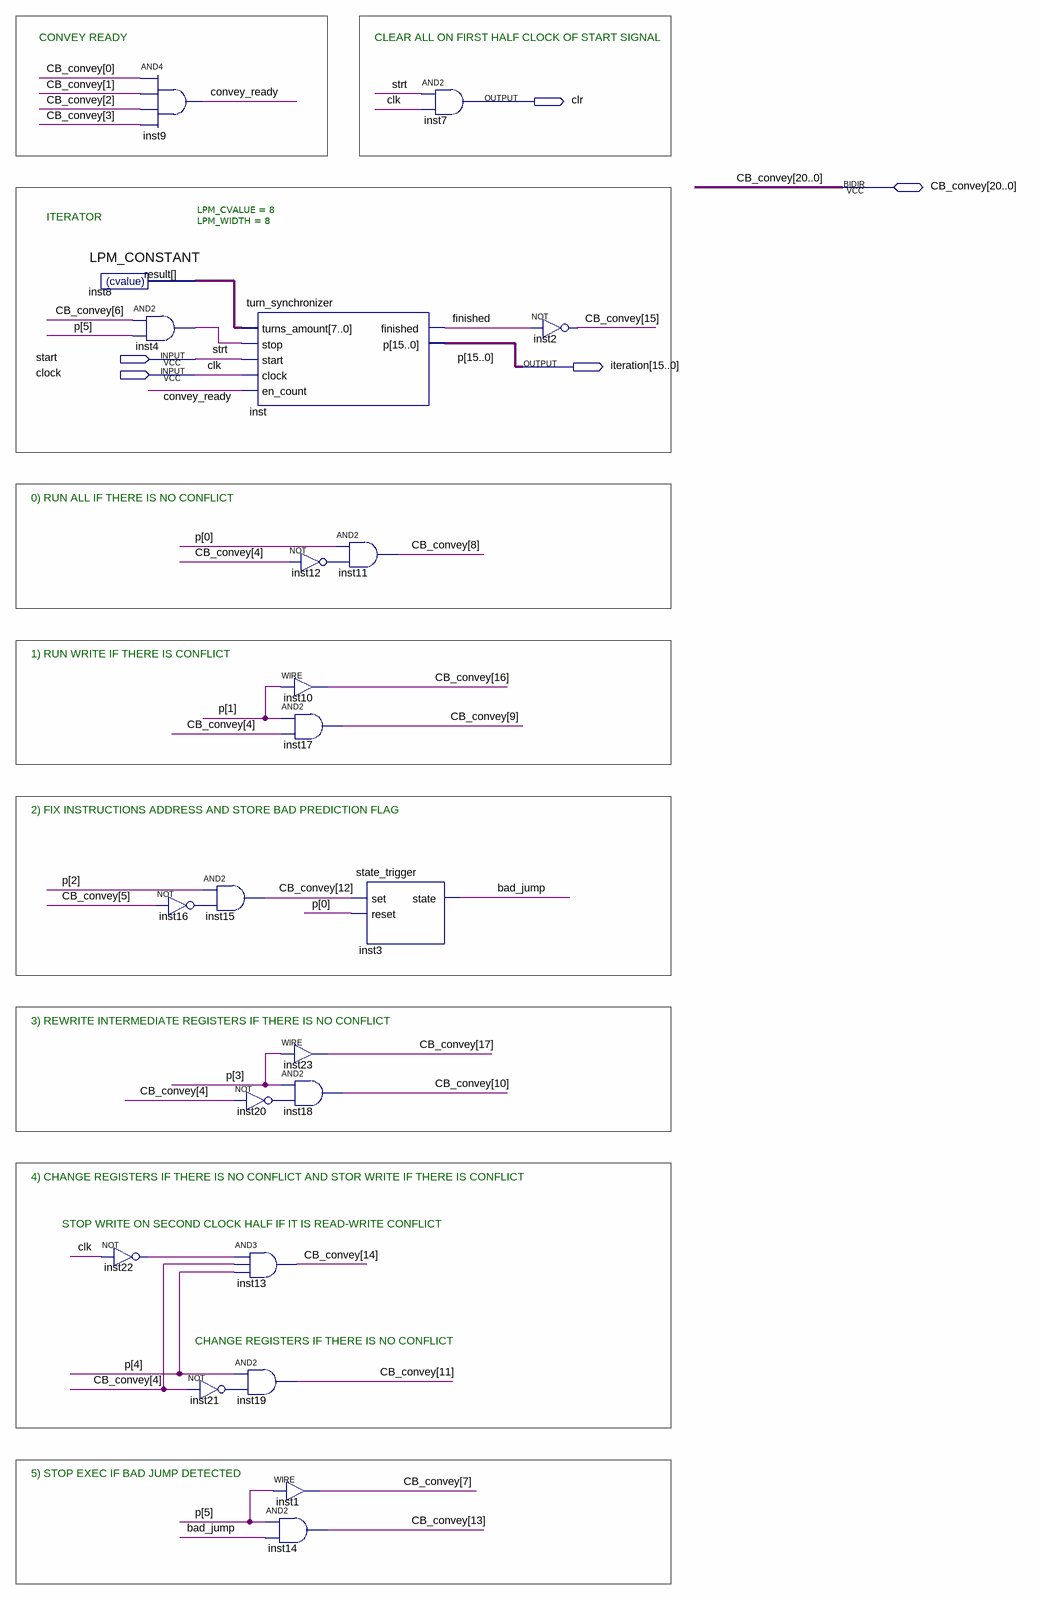
[diagram p0: schematic sheet]
// Quartus schematic CM.bdf as structural Verilog: 22 symbols, 5 pins
module CM (
  input  start,
  input  clock,
  inout  [20:0] CB_convey,
  output clr,
  output [15:0] iteration
);

  wire bad_jump, convey_ready, finished, inst4_out, inst12_out, inst16_out, inst20_out, inst21_out,
       inst22_out;
  wire [7:0] inst8_result;

  LPM_CONSTANT #(.LPM_CVALUE(8), .LPM_WIDTH(8)) inst8 (.result(inst8_result));
  and inst9 (convey_ready, CB_convey[0], CB_convey[1], CB_convey[2], CB_convey[3]);
  and inst4 (inst4_out, CB_convey[6], iteration[5]);
  not inst16 (inst16_out, CB_convey[5]);
  not inst22 (inst22_out, clock);
  and inst15 (CB_convey[12], iteration[2], inst16_out);
  not inst21 (inst21_out, CB_convey[4]);
  turn_synchronizer inst (
    .turns_amount(inst8_result), .stop(inst4_out), .start(start), .clock(clock), .en_count(convey_ready),
    .finished(finished), .p(iteration));
  assign CB_convey[16] = iteration[1];  // WIRE inst10
  and inst17 (CB_convey[9], iteration[1], CB_convey[4]);
  assign CB_convey[17] = iteration[3];  // WIRE inst23
  and inst18 (CB_convey[10], iteration[3], inst20_out);
  not inst20 (inst20_out, CB_convey[4]);
  and inst13 (CB_convey[14], inst22_out, CB_convey[4], iteration[4]);
  and inst19 (CB_convey[11], iteration[4], inst21_out);
  assign CB_convey[7] = iteration[5];  // WIRE inst1
  and inst14 (CB_convey[13], iteration[5], bad_jump);
  and inst11 (CB_convey[8], iteration[0], inst12_out);
  not inst12 (inst12_out, CB_convey[4]);
  state_trigger inst3 (.set(CB_convey[12]), .reset(iteration[0]), .state(bad_jump));
  and inst7 (clr, start, clock);
  not inst2 (CB_convey[15], finished);

  // Other names for the same wires on the sheet: clk = clock; p[15:0] = iteration; strt = start

  // Notes on the sheet:
  //   CONVEY READY
  //   CLEAR ALL ON FIRST HALF CLOCK OF START SIGNAL
  //   ITERATOR
  //   0) RUN ALL IF THERE IS NO CONFLICT
  //   1) RUN WRITE IF THERE IS CONFLICT
  //   2) FIX INSTRUCTIONS ADDRESS AND STORE BAD PREDICTION FLAG
  //   3) REWRITE INTERMEDIATE REGISTERS IF THERE IS NO CONFLICT
  //   4) CHANGE REGISTERS IF THERE IS NO CONFLICT AND STOR WRITE IF THERE IS CONFLICT
  //   STOP WRITE ON SECOND CLOCK HALF IF IT IS READ-WRITE CONFLICT
  //   CHANGE REGISTERS IF THERE IS NO CONFLICT
  //   5) STOP EXEC IF BAD JUMP DETECTED
endmodule
